# EAGLE design USBPowerBoost_SMD_v0_1_5 (EAGLE 5.11)
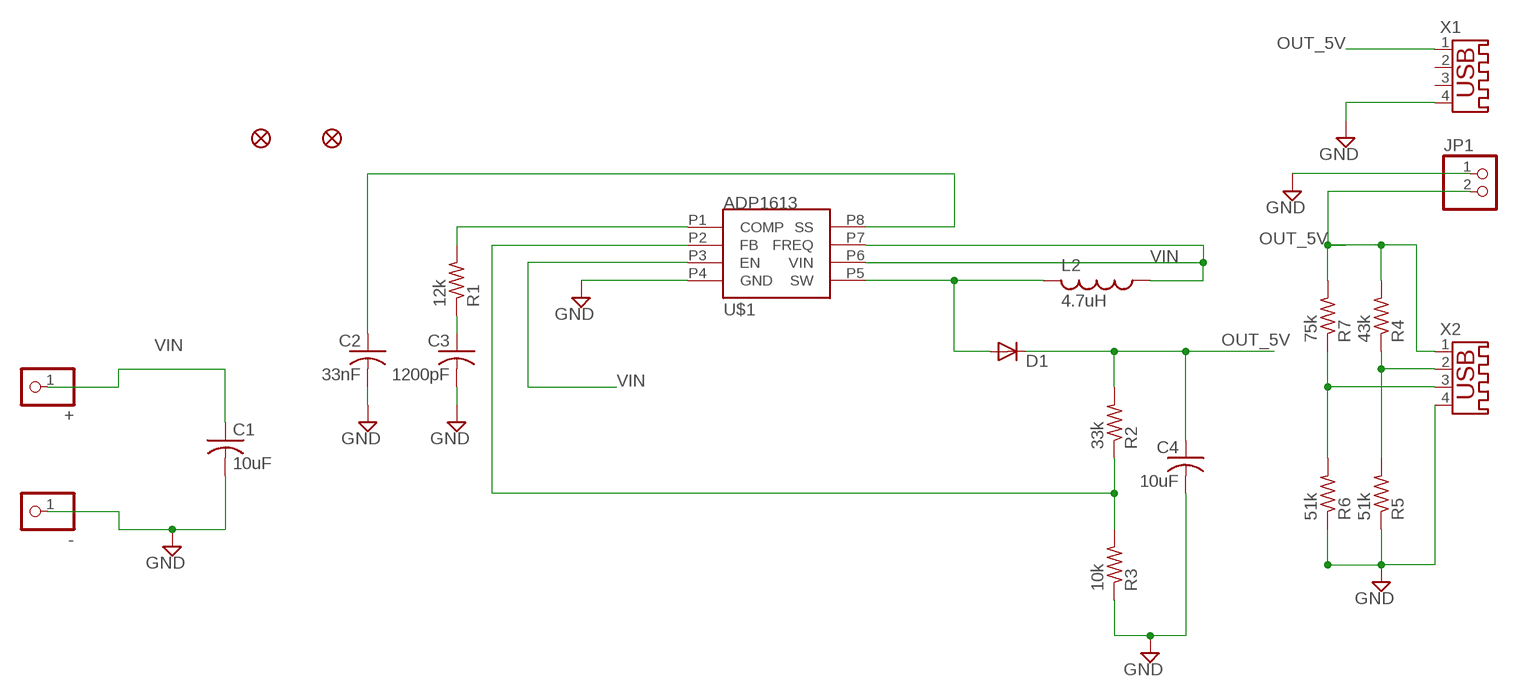
[diagram p0: schematic, sheet 1]

## Parts
+  PINHD-1X1  [1X01]
-  PINHD-1X1  [1X01]
C1  10uF  C-USC1206  [C1206]
C2  33nF  C-USC0603  [C0603]
C3  1200pF  C-USC0603  [C0603]
C4  10uF  C-USC1206  [C1206]
D1  DIODE-DO-214AC  [DO-214AC]
JP1  HEADER-1X2  [1X02_OVAL]
JP2  FIDUCIAL1X2  [FIDUCIAL-1X2]
JP3  FIDUCIAL1X2  [FIDUCIAL-1X2]
L2  4.7uH  L-USL1812  [L1812]
R1  12k  R-US_R0603  [R0603]
R2  33k  R-US_R0603  [R0603]
R3  10k  R-US_R0603  [R0603]
R4  43k  R-US_R0603  [R0603]
R5  51k  R-US_R0603  [R0603]
R6  51k  R-US_R0603  [R0603]
R7  75k  R-US_R0603  [R0603]
U$1  ADP1613  [RM-8]
X1  USB-A003  [USB-A003]
X2  USB-A003  [USB-A003]

## Nets
5V: D1.A L2.2 U$1.P5(SW)
GND: -.1 C1.2 C2.2 C3.2 C4.2 JP1.1 R3.1 R5.1 R6.1 U$1.P4(GND) X1.4 X2.4
N$2: R2.1 R3.2 U$1.P2(FB)
N$3: R4.1 R5.2 X2.2
N$5: R1.2 U$1.P1(COMP)
N$7: C3.1 R1.1
N$11: C2.1 U$1.P8(SS)
N$15: R6.2 R7.1 X2.3
OUT_5V: C4.1 D1.C JP1.2 R2.2 R4.2 R7.2 X1.1 X2.1
VIN: +.1 C1.1 L2.1 U$1.P3(EN) U$1.P6(VIN) U$1.P7(FREQ)
Unconnected: X1.2 X1.3

## Library data of the parts
+ - = pinhead:PINHD-1X1: PIN HEADER
C1-C4 = rcl:C-US: CAPACITOR, American symbol
D1 = diode:DIODE-: DIODE
JP1 = microbuilder:HEADER-1X2: PIN HEADER
JP2 JP3 = SparkFun:FIDUCIAL: Fiducial Alignment Points Various fiducial points for machine vision alignment.
L2 = rcl:L-US: INDUCTOR, American symbol
R1-R7 = resistor:R-US_: RESISTOR, American symbol
U$1 = adp1613:ADP1613
X1 X2 = con-yamaichi:USB-A003: USB connector; OC_FARNELL: unknown; OC_NEWARK: unknown

## Board
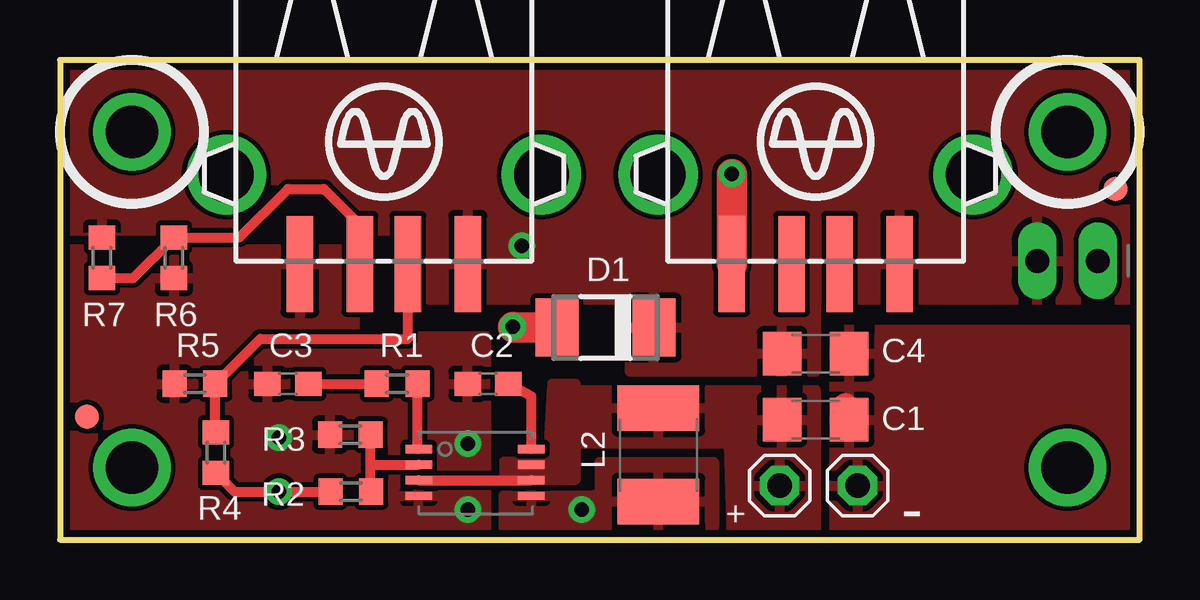
[diagram p1: board, top side]
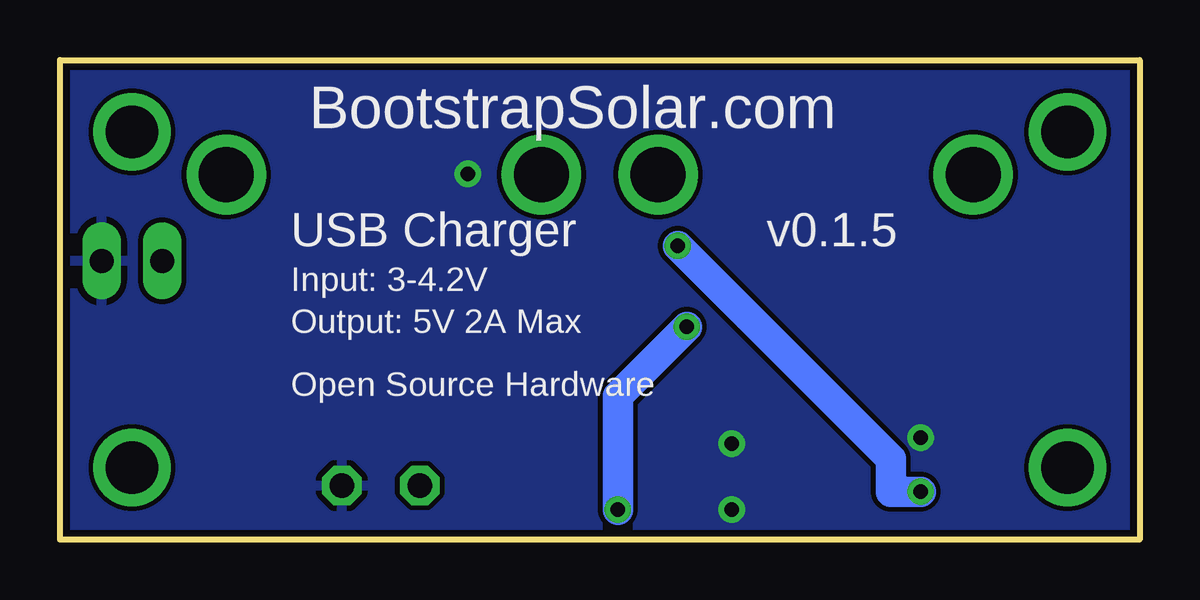
[diagram p2: board, bottom side, seen from below]

Size 45 x 20 mm. Coordinates in mm from the lower left corner, seen from the top.
Outline: 0,0 45,0 45,20 0,20 0,0
Copper layers (1*16): Top 0.035mm / dielectric 1.5mm / Bottom 0.035mm
Design rules "SparkFun *": minimum track width 8mil, minimum drill 20mil, track to track 8mil, track to pad 8mil, pad to pad 8mil, via to via 8mil, smd to smd 8mil, copper to edge 11mil, drill to drill 8mil, minimum pad ring 12mil, minimum via ring 10mil, stop-mask expansion 4mil, vias tented up to drill 25mil, thermal gap 10mil

### Footprints (pad centres in the part's own frame; a part is rotated, then mirrored left to right if it is on the bottom)
1X01 = drill 1.016 octagon: 1 0,0
C1206 = smd 1.6 x 1.8: 1 -1.4,0; 2 1.4,0
C0603 = smd 1.1 x 1: 1 -0.85,0; 2 0.85,0
DO-214AC = smd 1.8 x 2.4: A 2.025,0; C -2.025,0
1X02_OVAL = drill 1 long: 1 -1.27,0; 2 1.27,0
FIDUCIAL-1X2 = smd 1 x 1: 1 0,0
L1812 = smd 1.9 x 3.4: 1 -1.95,0; 2 1.95,0
R0603 = smd 1 x 1.1: 1 -0.85,0; 2 0.85,0
RM-8 = smd 1.1 x 0.35: P1 -4.7,0.7; P2 -4.7,0.05; P3 -4.7,-0.6; P4 -4.7,-1.25; P5 0,-1.25; P6 0,-0.6; P7 0,0.05; P8 0,0.7
USB-A003 = smd 1.12 x 4: 1 -3.5,14; 2 -1,14; 3 1,14; 4 3.5,14 | drill 2.3 round: P$1 -6.57,10.28; P$2 6.57,10.28

### Placement (x,y rotation side)
+  30,2.25 0 top
-  33.25,2.25 0 top
C1  31.5,5 0 top
C2  17.84,6.5 180 top
C3  9.5,6.5 180 top
C4  31.5,7.75 0 top
D1  22.74,8.84 180 top
JP1  42,11.62 180 top
JP2  1.12,5.12 0 top
JP3  44,14.62 0 top
L2  24.95,3.53 270 top
R1  14.05,6.5 0 top
R2  12.12,2 180 top
R3  12.1,4.38 0 top
R4  6.5,3.62 270 top
R5  5.62,6.5 0 top
R6  4.75,11.75 90 top
R7  1.75,11.75 90 top
U$1  19.65,3.08 0 top
X1  31.5,25.5 180 top
X2  13.5,25.5 180 top

### Tracks (layer width: path | path; a pad name or v marks a point on that pad's centre or on a via)
5V  (via drill 0.6)
  Top 1.27: v18.88,8.88 18.91,8.84 D1.A
  Bottom 1.27: v18.88,8.88 21.75,6 v21.75,1.25
  pour Top: 18.5,1.85 22.25,1.85 22.5,2 22.5,3.25 27.25,3.25 27.25,0.5 18.5,0.5
GND  (via drill 0.6)
  Top 1.016: C1.2 32.73,5.59
  Top 1.27: X1.4 v28,15.25
  other vias: 9.12,4.25 17,4 17,1.25
  pour Bottom: -0.1,20.3 45,20.3 45,-0.2 -0.1,-0.2
  pour Top: 0.38,12.12 12.38,12.12 12.25,8.5 17.75,8.5 17.75,0.25 0.25,0.25
  pour Top: 45.38,8.75 32.25,8.75 32.25,-0.25 45.38,-0.25
N$1  (via drill 2.2 pad 2.18)
  other vias: 3,17
N$2
  Top 0.406: 12.95,3.12 12.95,2.02 R2.1 | 12.95,3.12 R3.2 | 12.95,3.12 U$1.P2
N$3
  Top 0.406: R4.1 6.47,4.47 R5.2 8.35,8.38 14.5,8.38 X2.2
N$4  (via drill 2.2)
  other vias: 3,3
N$5
  Top 0.406: U$1.P1 14.9,3.77 R1.2
N$6  (via drill 2.2 pad 2.18)
  other vias: 42,3
N$7
  Top 0.406: C3.1 R1.1
N$11
  Top 0.406: U$1.P8 19.65,5.97 C2.1
N$15
  Top 0.406: R7.1 3.05,10.9 R6.2 7.47,12.6 9.5,14.62 11,14.62 12.5,13.12 X2.3
N$20  (via drill 2.2 pad 2.18)
  other vias: 42,17
OUT_5V  (via drill 0.6)
  Top 0.406: R4.2 7.28,2 v9.12,2 R2.2
  Bottom 1.27: v9.12,2 10.38,2 10.38,3.38 v19.25,12.25
  pour Top: 46,10 15.38,10 15.38,12.88 -0.5,12.88 -0.5,21 46,21
  pour Top: 23.75,12.25 31.5,12.25 31.5,7 23.75,7
VIN
  Top 0.406: U$1.P3 U$1.P6
  pour Top (no thermals): 18.5,2.5 21.5,2.5 21.5,6.5 20.5,6.5 20.5,3.25 18.5,3.25
  pour Top: 20.5,6.25 31.5,6.25 31.5,0 28,0 27.88,4 20.38,4

### Text on the board
bNames: BootstrapSolar.com | v0.1.5 | USB Charger | Input: 3-4.2V | Output: 5V 2A Max | Open Source Hardware